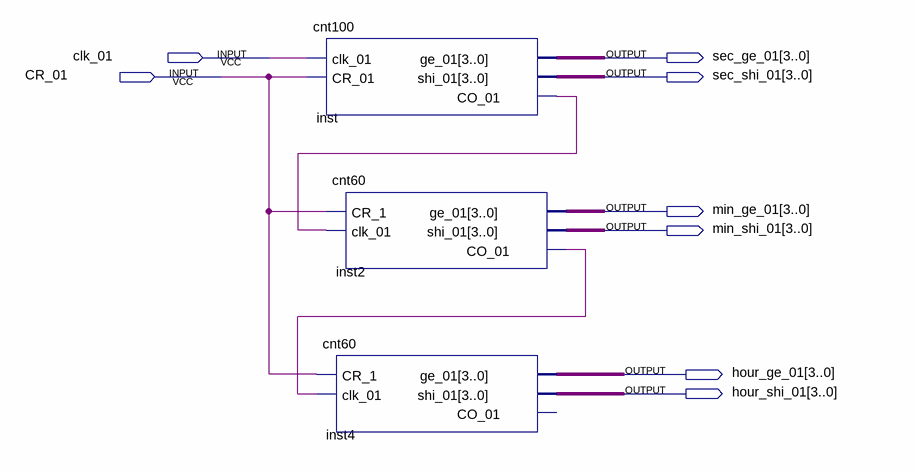
[diagram p0: schematic sheet]
// Quartus schematic chron.bdf as structural Verilog: 3 symbols, 8 pins
module chron (
  input  clk_01,
  input  CR_01,
  output [3:0] sec_ge_01,
  output [3:0] sec_shi_01,
  output [3:0] min_ge_01,
  output [3:0] min_shi_01,
  output [3:0] hour_ge_01,
  output [3:0] hour_shi_01
);

  wire inst2_co_01, inst_co_01;

  cnt100 inst (.clk_01(clk_01), .CR_01(CR_01), .ge_01(sec_ge_01), .shi_01(sec_shi_01), .CO_01(inst_co_01));
  cnt60 inst2 (.CR_1(CR_01), .clk_01(inst_co_01), .ge_01(min_ge_01), .shi_01(min_shi_01), .CO_01(inst2_co_01));
  cnt60 inst4 (.CR_1(CR_01), .clk_01(inst2_co_01), .ge_01(hour_ge_01), .shi_01(hour_shi_01));  // open: CO_01
endmodule
